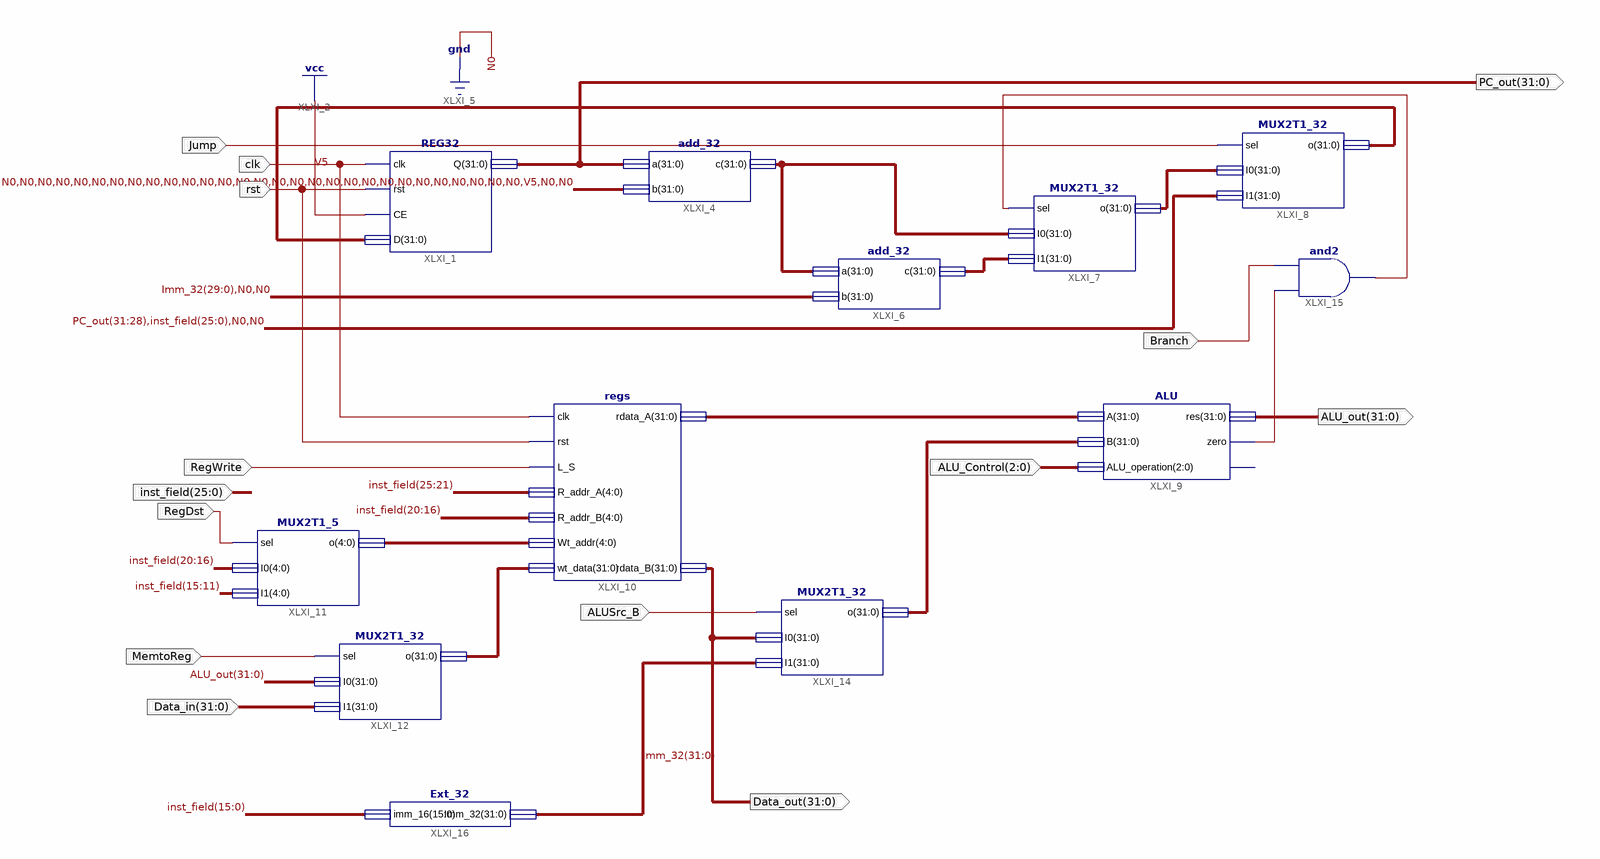
[diagram p0: schematic sheet 1]
// Xilinx ISE schematic Data_path.sch (kintex7) as structural Verilog: 12 symbols, 14 ports
module Data_path (
  input  clk,
  input  rst,
  input  Jump,
  input  RegWrite,
  input  [25:0] inst_field,
  input  RegDst,
  input  MemtoReg,
  input  [31:0] Data_in,
  input  [2:0] ALU_Control,
  input  ALUSrc_B,
  input  Branch,
  output [31:0] PC_out,
  output [31:0] Data_out,
  output [31:0] ALU_out
);

  wire XLXN_81, XLXN_85;
  wire [4:0] XLXN_31;
  wire [31:0] Imm_32, XLXN_4, XLXN_9, XLXN_13, XLXN_14, XLXN_51, XLXN_57, XLXN_70;

  REG32 XLXI_1 (.clk(clk), .rst(rst), .CE(1'b1), .D(XLXN_4), .Q(PC_out));
  add_32 XLXI_4 (.a(PC_out), .b(32'b00000000000000000000000000000100), .c(XLXN_9));
  add_32 XLXI_6 (.a(XLXN_9), .b({Imm_32[29:0], 2'b00}), .c(XLXN_13));
  MUX2T1_32 XLXI_7 (.sel(XLXN_85), .I0(XLXN_9), .I1(XLXN_13), .o(XLXN_14));
  MUX2T1_32 XLXI_8 (.sel(Jump), .I0(XLXN_14), .I1({PC_out[31:28], inst_field, 2'b00}), .o(XLXN_4));
  ALU XLXI_9 (.A(XLXN_51), .B(XLXN_57), .ALU_operation(ALU_Control), .res(ALU_out), .zero(XLXN_81));  // open: overflow
  regs XLXI_10 (
    .clk(clk), .rst(rst), .L_S(RegWrite), .R_addr_A(inst_field[25:21]), .R_addr_B(inst_field[20:16]),
    .Wt_addr(XLXN_31), .wt_data(XLXN_70), .rdata_A(XLXN_51), .rdata_B(Data_out));
  MUX2T1_5 XLXI_11 (.sel(RegDst), .I0(inst_field[20:16]), .I1(inst_field[15:11]), .o(XLXN_31));
  MUX2T1_32 XLXI_12 (.sel(MemtoReg), .I0(ALU_out), .I1(Data_in), .o(XLXN_70));
  MUX2T1_32 XLXI_14 (.sel(ALUSrc_B), .I0(Data_out), .I1(Imm_32), .o(XLXN_57));
  and XLXI_15 (XLXN_85, XLXN_81, Branch);
  Ext_32 XLXI_16 (.imm_16(inst_field[15:0]), .Imm_32(Imm_32));
endmodule
